# Altium schematic sheet Patient Protection.SchDoc: EEG Measurement Circuit
size A3; Date: 24/01/2025; DrawnBy: Giang Phan Truong; SheetNumber: 3; SheetTotal: 7
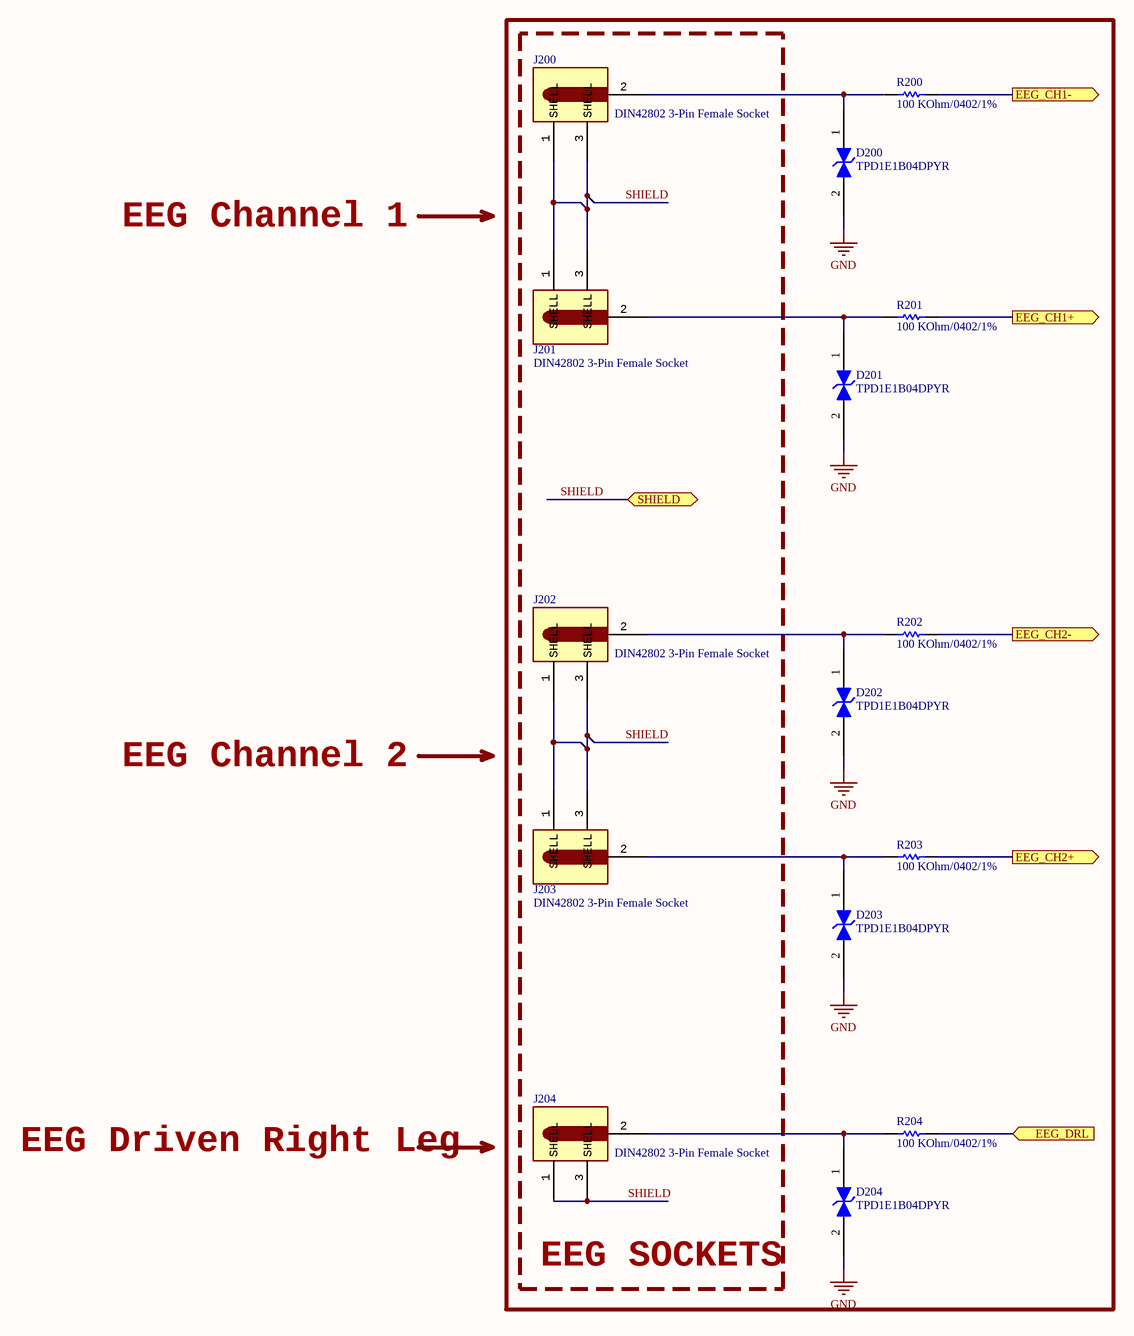
[diagram p0: Patient Protection.SchDoc]

## Parts
D200  TPD1E1B04DPYR  [DIO_TPD1E05U06DPYR]
D201  TPD1E1B04DPYR  [DIO_TPD1E05U06DPYR]
D202  TPD1E1B04DPYR  [DIO_TPD1E05U06DPYR]
D203  TPD1E1B04DPYR  [DIO_TPD1E05U06DPYR]
D204  TPD1E1B04DPYR  [DIO_TPD1E05U06DPYR]
J200  value DIN42802 3-Pin Female Socket  [DIN42802-1.5MM SOCKET]  (hidden comment: DIN42802 1.5mm)
J201  value DIN42802 3-Pin Female Socket  [DIN42802-1.5MM SOCKET]  (hidden comment: DIN42802 1.5mm)
J202  value DIN42802 3-Pin Female Socket  [DIN42802-1.5MM SOCKET]  (hidden comment: DIN42802 1.5mm)
J203  value DIN42802 3-Pin Female Socket  [DIN42802-1.5MM SOCKET]  (hidden comment: DIN42802 1.5mm)
J204  value DIN42802 3-Pin Female Socket  [DIN42802-1.5MM SOCKET]  (hidden comment: DIN42802 1.5mm)
R200  value 100 KOhm/0402/1%  [R0402]  (hidden comment: Resistor 100 KOhm 0402 1%)
R201  value 100 KOhm/0402/1%  [R0402]  (hidden comment: Resistor 100 KOhm 0402 1%)
R202  value 100 KOhm/0402/1%  [R0402]  (hidden comment: Resistor 100 KOhm 0402 1%)
R203  value 100 KOhm/0402/1%  [R0402]  (hidden comment: Resistor 100 KOhm 0402 1%)
R204  value 100 KOhm/0402/1%  [R0402]  (hidden comment: Resistor 100 KOhm 0402 1%)

## Blocks framed on the sheet
EEG SOCKETS: J200-J204

## Ports
EEG_CH1+ (out, see Block Diagram[3B], EEG Preprocessing[1A]), EEG_CH1- (out, see Block Diagram[3B], EEG Preprocessing[1A]), EEG_CH2+ (out, see Block Diagram[3B], EEG Preprocessing[1B]), EEG_CH2- (out, see Block Diagram[3B], EEG Preprocessing[1B]), EEG_DRL (in, see Block Diagram[3B], EEG Preprocessing[3C]), SHIELD (bidir, see Block Diagram[3B], ADC[3B], EEG Preprocessing[5C])

## Nets
GND: D200.2 D201.2 D202.2 D203.2 D204.2
EEG_CH1+: R201.2 ; port EEG_CH1+
EEG_CH1-: R200.2 ; port EEG_CH1-
EEG_CH2+: R203.2 ; port EEG_CH2+
EEG_CH2-: R202.2 ; port EEG_CH2-
EEG_DRL: R204.2 ; port EEG_DRL
SHIELD: J200.1(SHELL) J200.3(SHELL) J201.1(SHELL) J201.3(SHELL) J202.1(SHELL) J202.3(SHELL) J203.1(SHELL) J203.3(SHELL) J204.1(SHELL) J204.3(SHELL) ; port SHIELD
NetD200_1: D200.1 J200.2(PORT) R200.1
NetD201_1: D201.1 J201.2(PORT) R201.1
NetD202_1: D202.1 J202.2(PORT) R202.1
NetD203_1: D203.1 J203.2(PORT) R203.1
NetD204_1: D204.1 J204.2(PORT) R204.1

## Notes on the sheet
- EEG Channel 1
- EEG Channel 2
- EEG Driven Right Leg
- Project Name:
- Size
- Size:
- A3
- Revision:
- Drawn By:
- Date:
- File:
- Last Modified:
- Checked By:
- Sheet
- of

## Library data of the parts
D200-D204 = TPD1E1B04DPYR: 8.5V (Typ) Clamp 6.3A (8/20µs) Ipp Tvs Diode Surface Mount 2-X1SON (1x.60); MF: Texas Instruments; Mouser-Purchase-URL: https://snapeda.com/shop?store=Mouser&id=616615; Price: None; Availability: Warning; SnapEDA_Link: https://www.snapeda.com/parts/TPD1E1B04DPYR/Texas%20Instruments/view-part/616615/?ref=snap; Texas_Instruments-Purchase-URL: https://snapeda.com/shop?store=Texas+Instruments&id=616615; Package: X1SON-2 Texas Instruments; MP: TPD1E1B04DPYR; Value: TPD1E1B04DPYR
J200-J204 = DIN42802 1.5mm: 3 PIN Socket Female Socket for PCB EEG EMG DIN42802 1.5 mm Connector; ComponentLink1Description: Buy; ComponentLink1URL: https://www.alibaba.com/product-detail/3-PIN-Socket-Female-Socket-for_62497934533.html?chatToken=TDFKeWNGRlpkWFZTWmtkNFRYRnZjVWxhVTBsU2RVcHNkRVpKVTJsMlRteERiM0ZyWlhrM2VHMXhZeTkwTVVSb2RIQnFRMGxKTmtONE9GSllWWFFyVGtka2JsY3ZLMjB6UVdnMmRsaGxWbVZpU2xFNU5HeHRNWHBhVjJNdmFXcHlSelp0VHpKc01sVnFjMGRSYUZSbkwwRm9SM0ZJYjNSd1UxVTFORmszTUhKcGRERnVaVnBHVjJsaVQwdFRTRGx6WnpCcFVURnhXbWRsZHl0UU56bE5NRkJsVjBnelNXRjZibkJGUFE9PSZ2ZXJzaW9uPTIuMC4w&encryptTargetLoginId=8pctgRBMALPo2t4oyiyajgkFqFUijPBH6wdkfYSa%2Bs4%3D
R200-R204 = Resistor 100 KOhm 0402 1%: Code 104, 1/16W 1%; ComponentLink1Description: Buy; ComponentLink1URL: https://www.thegioiic.com/dien-tro-100-kohm-0402-1-